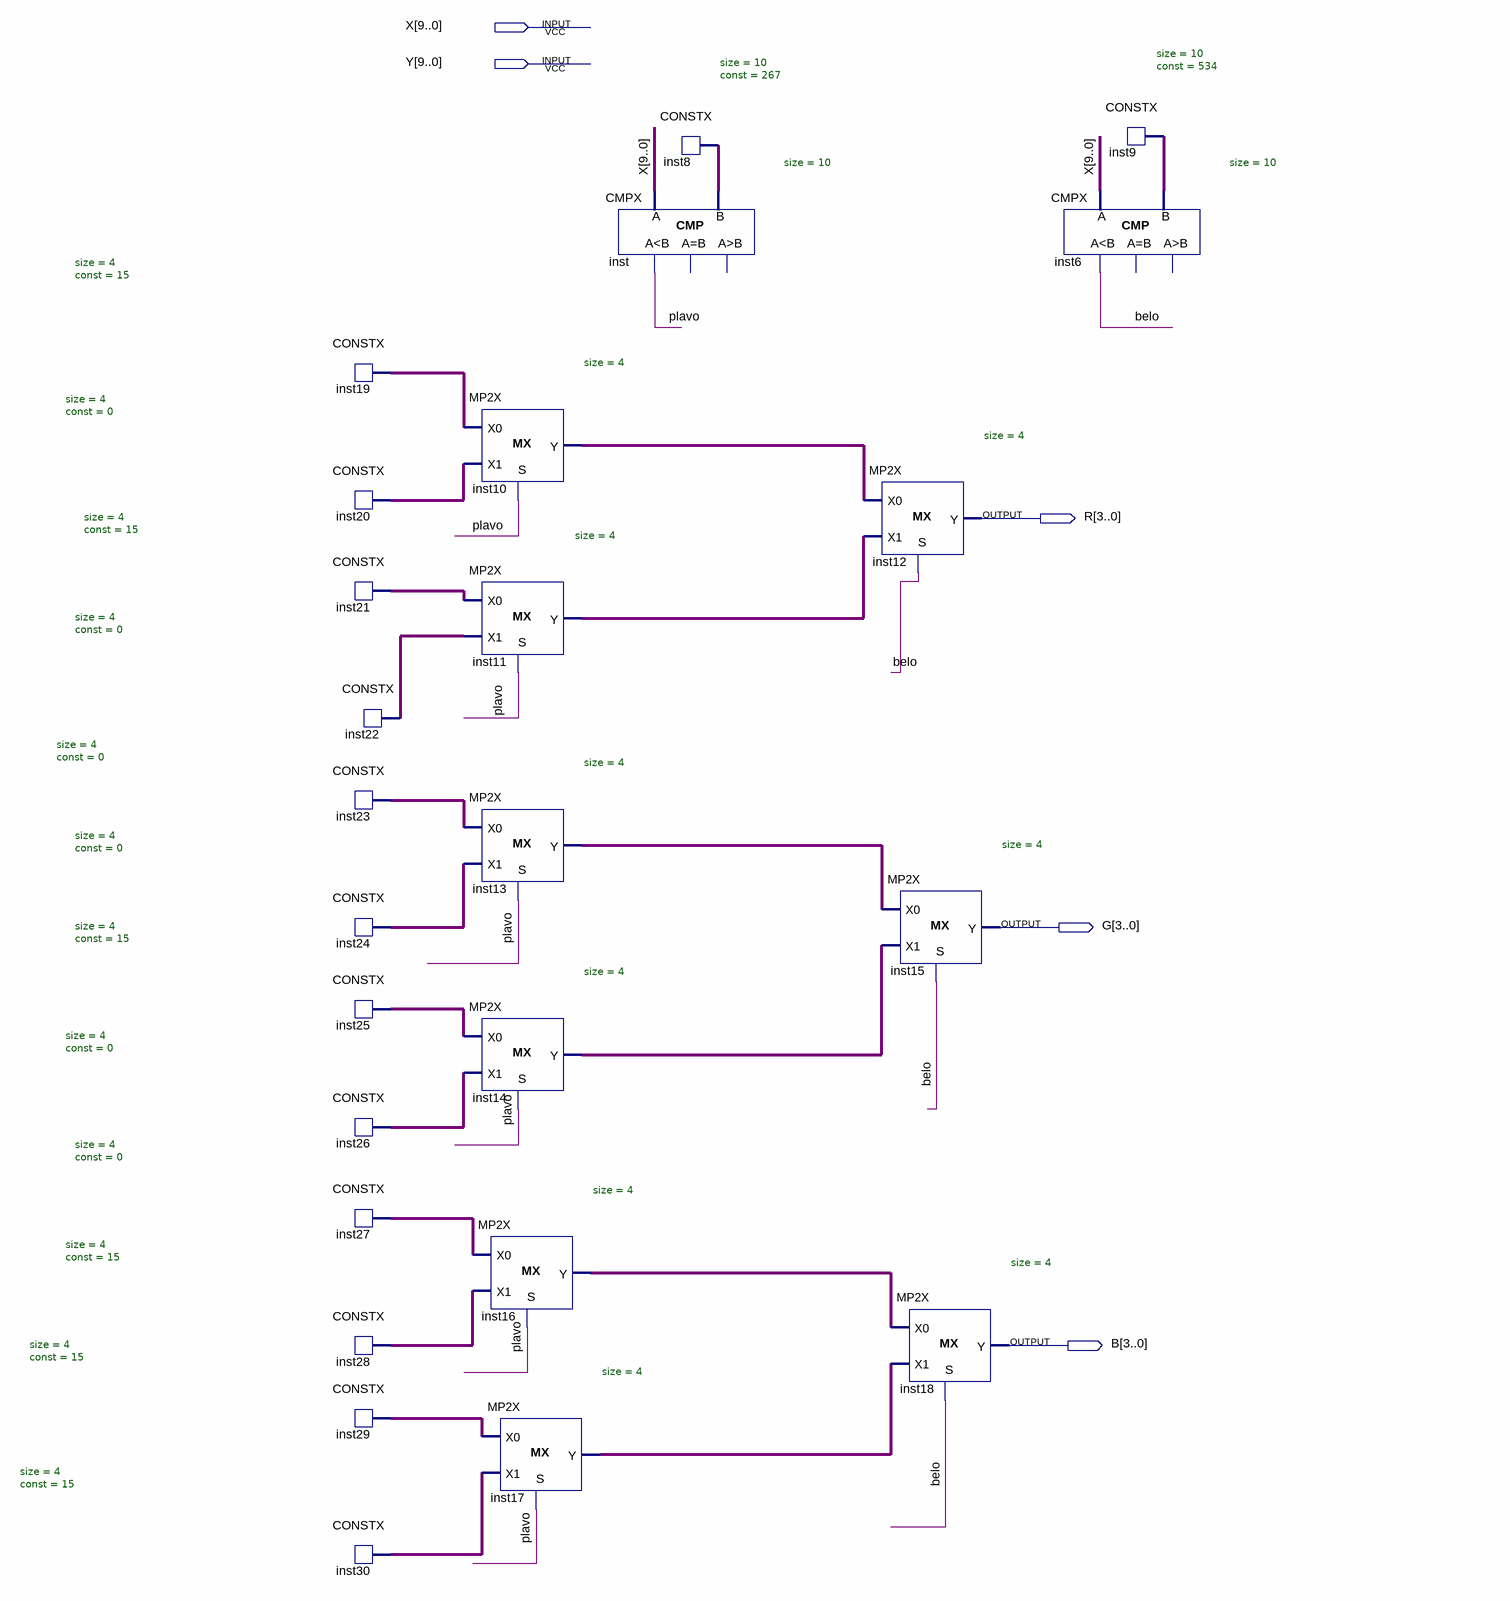
[diagram p0: schematic sheet]
// Quartus schematic FRANCUSKA.bdf as structural Verilog: 25 symbols, 5 pins
module FRANCUSKA (
  input  [9:0] X,
  input  [9:0] Y,
  output [3:0] R,
  output [3:0] G,
  output [3:0] B
);

  wire belo, plavo;
  wire [3:0] inst10_y, inst11_y, inst13_y, inst14_y, inst16_y, inst17_y, inst19_data, inst20_data,
       inst21_data, inst22_data, inst23_data, inst24_data, inst25_data, inst26_data, inst27_data,
       inst28_data, inst29_data, inst30_data;
  wire [9:0] inst8_data, inst9_data;

  CONSTX #(.size(4), .\const (15)) inst19 (.data(inst19_data));
  CONSTX #(.size(4), .\const (0)) inst20 (.data(inst20_data));
  CONSTX #(.size(4), .\const (15)) inst21 (.data(inst21_data));
  CONSTX #(.size(4), .\const (0)) inst22 (.data(inst22_data));
  CONSTX #(.size(4), .\const (0)) inst23 (.data(inst23_data));
  CONSTX #(.size(4), .\const (0)) inst24 (.data(inst24_data));
  CONSTX #(.size(4), .\const (15)) inst25 (.data(inst25_data));
  CONSTX #(.size(4), .\const (0)) inst26 (.data(inst26_data));
  CONSTX #(.size(4), .\const (0)) inst27 (.data(inst27_data));
  CONSTX #(.size(4), .\const (15)) inst28 (.data(inst28_data));
  CONSTX #(.size(4), .\const (15)) inst29 (.data(inst29_data));
  CONSTX #(.size(4), .\const (15)) inst30 (.data(inst30_data));
  MP2X #(.size(4)) inst10 (.S(plavo), .X0(inst19_data), .X1(inst20_data), .Y(inst10_y));
  MP2X #(.size(4)) inst11 (.S(plavo), .X0(inst21_data), .X1(inst22_data), .Y(inst11_y));
  MP2X #(.size(4)) inst13 (.S(plavo), .X0(inst23_data), .X1(inst24_data), .Y(inst13_y));
  MP2X #(.size(4)) inst14 (.S(plavo), .X0(inst25_data), .X1(inst26_data), .Y(inst14_y));
  MP2X #(.size(4)) inst16 (.S(plavo), .X0(inst27_data), .X1(inst28_data), .Y(inst16_y));
  MP2X #(.size(4)) inst17 (.S(plavo), .X0(inst29_data), .X1(inst30_data), .Y(inst17_y));
  CMPX #(.size(10)) inst (.A(X), .B(inst8_data), .ls(plavo));  // open: eq, gr
  CONSTX #(.size(10), .\const (267)) inst8 (.data(inst8_data));
  MP2X #(.size(4)) inst12 (.S(belo), .X0(inst10_y), .X1(inst11_y), .Y(R));
  MP2X #(.size(4)) inst15 (.S(belo), .X0(inst13_y), .X1(inst14_y), .Y(G));
  MP2X #(.size(4)) inst18 (.S(belo), .X0(inst16_y), .X1(inst17_y), .Y(B));
  CMPX #(.size(10)) inst6 (.A(X), .B(inst9_data), .ls(belo));  // open: eq, gr
  CONSTX #(.size(10), .\const (534)) inst9 (.data(inst9_data));
endmodule
